# EAGLE design PCB-ENCODERSOLO (EAGLE 7.1.0)
SKAARHOJ 2012 Rotary Encoder Breakout Board
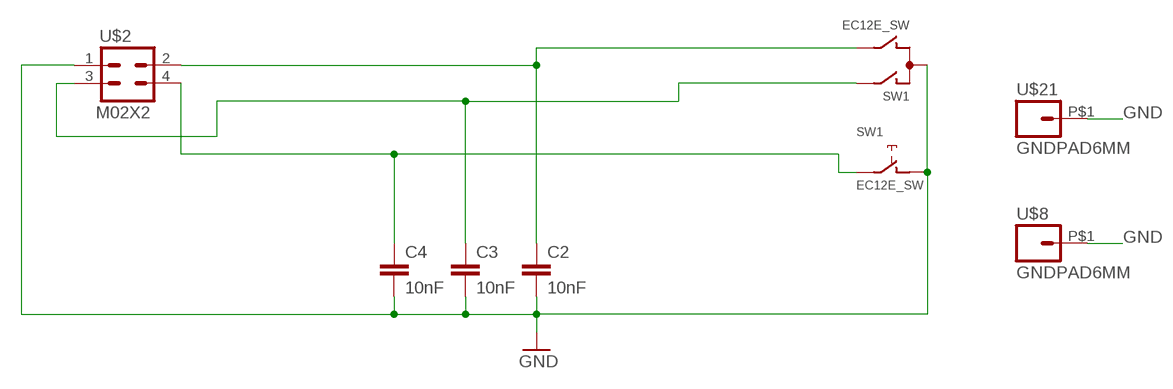
[diagram p0: schematic, sheet 1]

## Parts
C2  10nF  CAP0603-CAP  [0603-CAP]
C3  10nF  CAP0603-CAP  [0603-CAP]
C4  10nF  CAP0603-CAP  [0603-CAP]
SW1  EC12E_SW  [ALPS_EC12E_SW]
U$2  M02X2  [2X2]
U$8  GNDPAD6MM  [3.2MMPAD6MM]
U$21  GNDPAD6MM  [3.2MMPAD6MM]

## Nets
AD0: C4.1 SW1.E U$2.4
D3: C3.1 SW1.A U$2.3
GND [Power]: C2.2 C3.2 C4.2 SW1.C SW1.D U$2.1 U$8.P$1 U$21.P$1
N$124: C2.1 SW1.B U$2.2
Unconnected: SW1.GND1(G) SW1.GND2(G)

## Library data of the parts
C2-C4 = SparkFun:CAP: Capacitor Standard 0603 ceramic capacitor, and 0.1" leaded capacitor.
SW1 = switch-alps:EC12E_SW: ALPS rotary Encoder EC12E series with switch; MPN: EC12E2424407; OC_FARNELL: 1520813; OC_NEWARK: 74M1068
U$2 = SKAARHOJ:M02X2
U$8 U$21 = SKAARHOJ:GNDPAD

## Net classes
0 default: width 0.203 mm, drill 0.406 mm, clearance 0.203 mm
1 Power: width 0.254 mm, drill 0.406 mm, clearance 0.254 mm

## Board
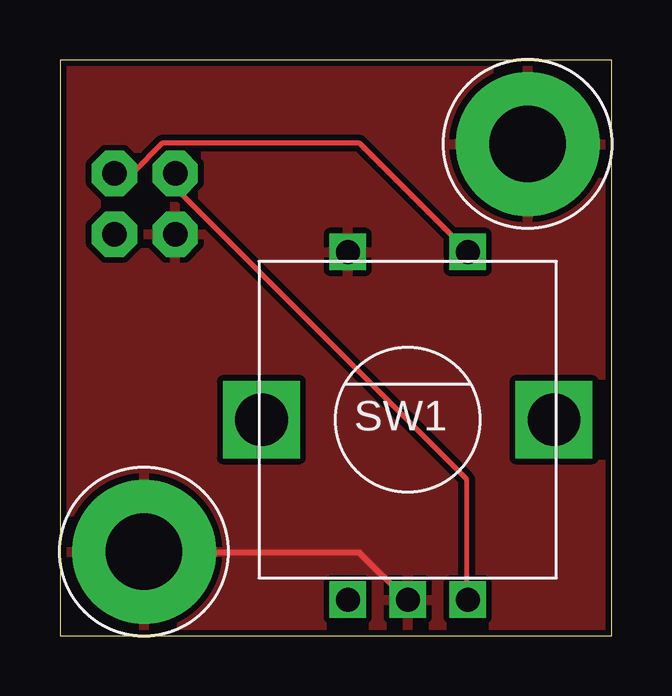
[diagram p1: board, top side]
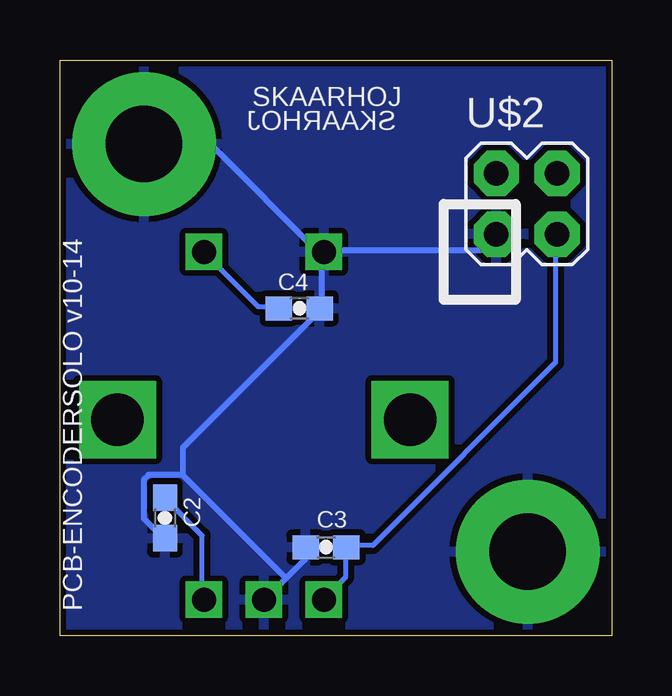
[diagram p2: board, bottom side, seen from below]

Size 23 x 24 mm. Coordinates in mm from the lower left corner, seen from the top.
Outline: 0,0 23,0 23,24 0,24 0,0
Copper layers (1*16): Top 0.035mm / dielectric 1.5mm / Bottom 0.035mm
Design rules "Fusion_eagle_rule_v1.1": minimum track width 6mil, minimum drill 12mil, track to track 6mil, track to pad 6mil, pad to pad 6mil, via to via 6mil, smd to smd 0mil, copper to edge 10mil, drill to drill 10mil, minimum pad ring 10mil, minimum via ring 6mil, stop-mask expansion 2mil, vias tented up to drill 100mil, thermal gap 10mil

### Footprints (pad centres in the part's own frame; a part is rotated, then mirrored left to right if it is on the bottom)
0603-CAP = smd 1.1 x 1: 1 -0.85,0; 2 0.85,0
ALPS_EC12E_SW = drill 1 square: A -2.5,-7.5; B 2.5,-7.5; C 0,-7.5; D -2.5,7; E 2.5,7 | drill 2.2 square: GND1 -6.1,0; GND2 6.1,0
2X2 = drill 1.016 pad 1.88 octagon: 1 -3.81,-1.27; 2 -3.81,1.27; 3 -1.27,-1.27; 4 -1.27,1.27
3.2MMPAD6MM = drill 3.2 pad 6: P$1 0,0

### Placement (x,y rotation side)
C2  18.62,4.91 270 bottom
C3  11.9,3.68 180 bottom
C4  13.02,13.64 0 bottom
SW1  14.5,9 0 top
U$2  1,18 0 bottom
U$8  19.5,20.5 0 top
U$21  3.5,3.5 0 top

### Tracks (layer width: path | path; a pad name or v marks a point on that pad's centre or on a via)
AD0
  Top 0.203: U$2.4 2.34,19.3 3.05,19.3 4.27,20.52 12.5,20.52 16.97,16.05 SW1.E
  Bottom 0.203: C4.1 13.92,13.72 14.73,13.72 16.97,15.95 SW1.E
D3
  Bottom 0.203: SW1.A 11.99,1.52 11.07,2.44 11.07,3.66 C3.1 10.97,3.76 9.96,3.76 2.34,11.38 2.34,16.66 U$2.3
GND
  Top 0.254: U$21.P$1 3.56,3.45 12.5,3.45 14.43,1.52 SW1.C
  Bottom 0.254: 13.56,2.39 14.43,1.52 SW1.C | 13.56,2.39 12.8,3.15 12.8,3.66 C3.2 | 17.88,6.71 19.3,6.71 19.51,6.5 19.51,4.88 18.69,4.06 C2.2 | 13.56,2.39 17.88,6.71 | SW1.D 12.09,15.95 12.09,13.72 C4.2 12.19,13.51 17.88,7.82 17.88,6.71 | SW1.D 11.89,16.05 5.49,16.05 4.88,16.66 U$2.1 | U$8.P$1 19.41,20.42 16.66,20.42 12.19,15.95 SW1.D
  pour Top: 0,0 23,0 23,24 0,24
  pour Bottom: 0,0 23,0 23,24 0,24
N$124
  Top 0.203: U$2.2 4.88,19.2 4.88,18.59 16.97,6.5 16.97,1.52 SW1.B
  Bottom 0.203: C2.1 18.59,5.69 17.07,4.17 17.07,1.52 SW1.B

### Text on the board
_bsilk: SKAARHOJ | SKAARHOJ | PCB-ENCODERSOLO v10-14